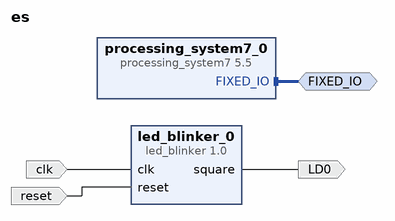
[diagram p0: block diagram of the top level]
# Vivado block design es, xc7z020clg484-1, Vivado 2020.2
create_bd_design es

create_bd_intf_port -mode Master -vlnv xilinx.com:display_processing_system7:fixedio_rtl:1.0 FIXED_IO
create_bd_port -dir I clk
create_bd_port -dir I reset
create_bd_port -dir O LD0

create_bd_cell -type ip -vlnv xilinx.com:ip:processing_system7:5.5 processing_system7_0
set_property -dict [list \
  CONFIG.PCW_EN_CLK0_PORT 0 \
  CONFIG.PCW_EN_RST0_PORT 0 \
  CONFIG.PCW_GPIO_MIO_GPIO_ENABLE 1 \
  CONFIG.PCW_GPIO_MIO_GPIO_IO MIO \
  CONFIG.PCW_I2C_RESET_ENABLE 0 \
  CONFIG.PCW_UIPARAM_DDR_ENABLE 0 \
  CONFIG.PCW_USB_RESET_ENABLE 0 \
  CONFIG.PCW_USE_M_AXI_GP0 0 \
] [get_bd_cells processing_system7_0]
# 188 more settings of processing_system7_0 are not shown: defaults, MIO pin electricals, DDR timing, and values the tool derives
create_bd_cell -type ip -vlnv ESDL:user:led_blinker:1.0 led_blinker_0
set_property -dict {CONFIG.CLK_divider_width 26} [get_bd_cells led_blinker_0]

# ---- connections ----

connect_bd_intf_net [get_bd_intf_ports FIXED_IO] [get_bd_intf_pins processing_system7_0/FIXED_IO]
connect_bd_net -net clk_0_1 [get_bd_ports clk] [get_bd_pins led_blinker_0/clk]
connect_bd_net -net reset_0_1 [get_bd_ports reset] [get_bd_pins led_blinker_0/reset]
connect_bd_net [get_bd_pins led_blinker_0/square] [get_bd_ports LD0]

validate_bd_design
save_bd_design
